# EAGLE schematic emitter follower_v2 (EAGLE 9.6.2)
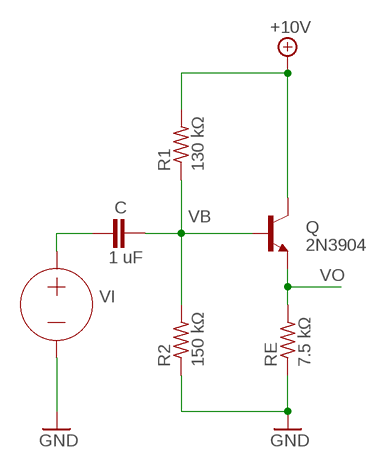
[diagram p0: schematic, sheet 1]

## Parts
C  1 uF  C-EU025-030X050  [C025-030X050]
Q  2N3904  [TO92]
R1  130 kΩ  R-US_0204/5  [0204/5]
R2  150 kΩ  R-US_0204/5  [0204/5]
RE  7.5 kΩ  R-US_0204/5  [0204/5]
VI  0V  VOLTAGE  (no package)

## Nets
+10V: Q.1(C) R1.2
GND: R2.1 RE.1 VI.-
N$1: Q.2(B)
N$2: C.1 VI.+
N$3: C.2 R1.1 R2.2
VO: Q.3(E) RE.2

## Notes on the sheet
- VB

## Library data of the parts
C = rcl:C-EU: CAPACITOR, European symbol; SPICEPREFIX: C
Q = transistor:2N3904: NPN TRANSISTOR
R1 R2 RE = rcl:R-US_: RESISTOR, American symbol; SPICEPREFIX: R
VI = ngspice-simulation:VOLTAGE: Independent Voltage Source, either DC, AC, PULSE, SINE, PWL, EXP, or SFFM